# EAGLE design AetherMesh Test Fixture LGA V1.0 (EAGLE 9.0.0)
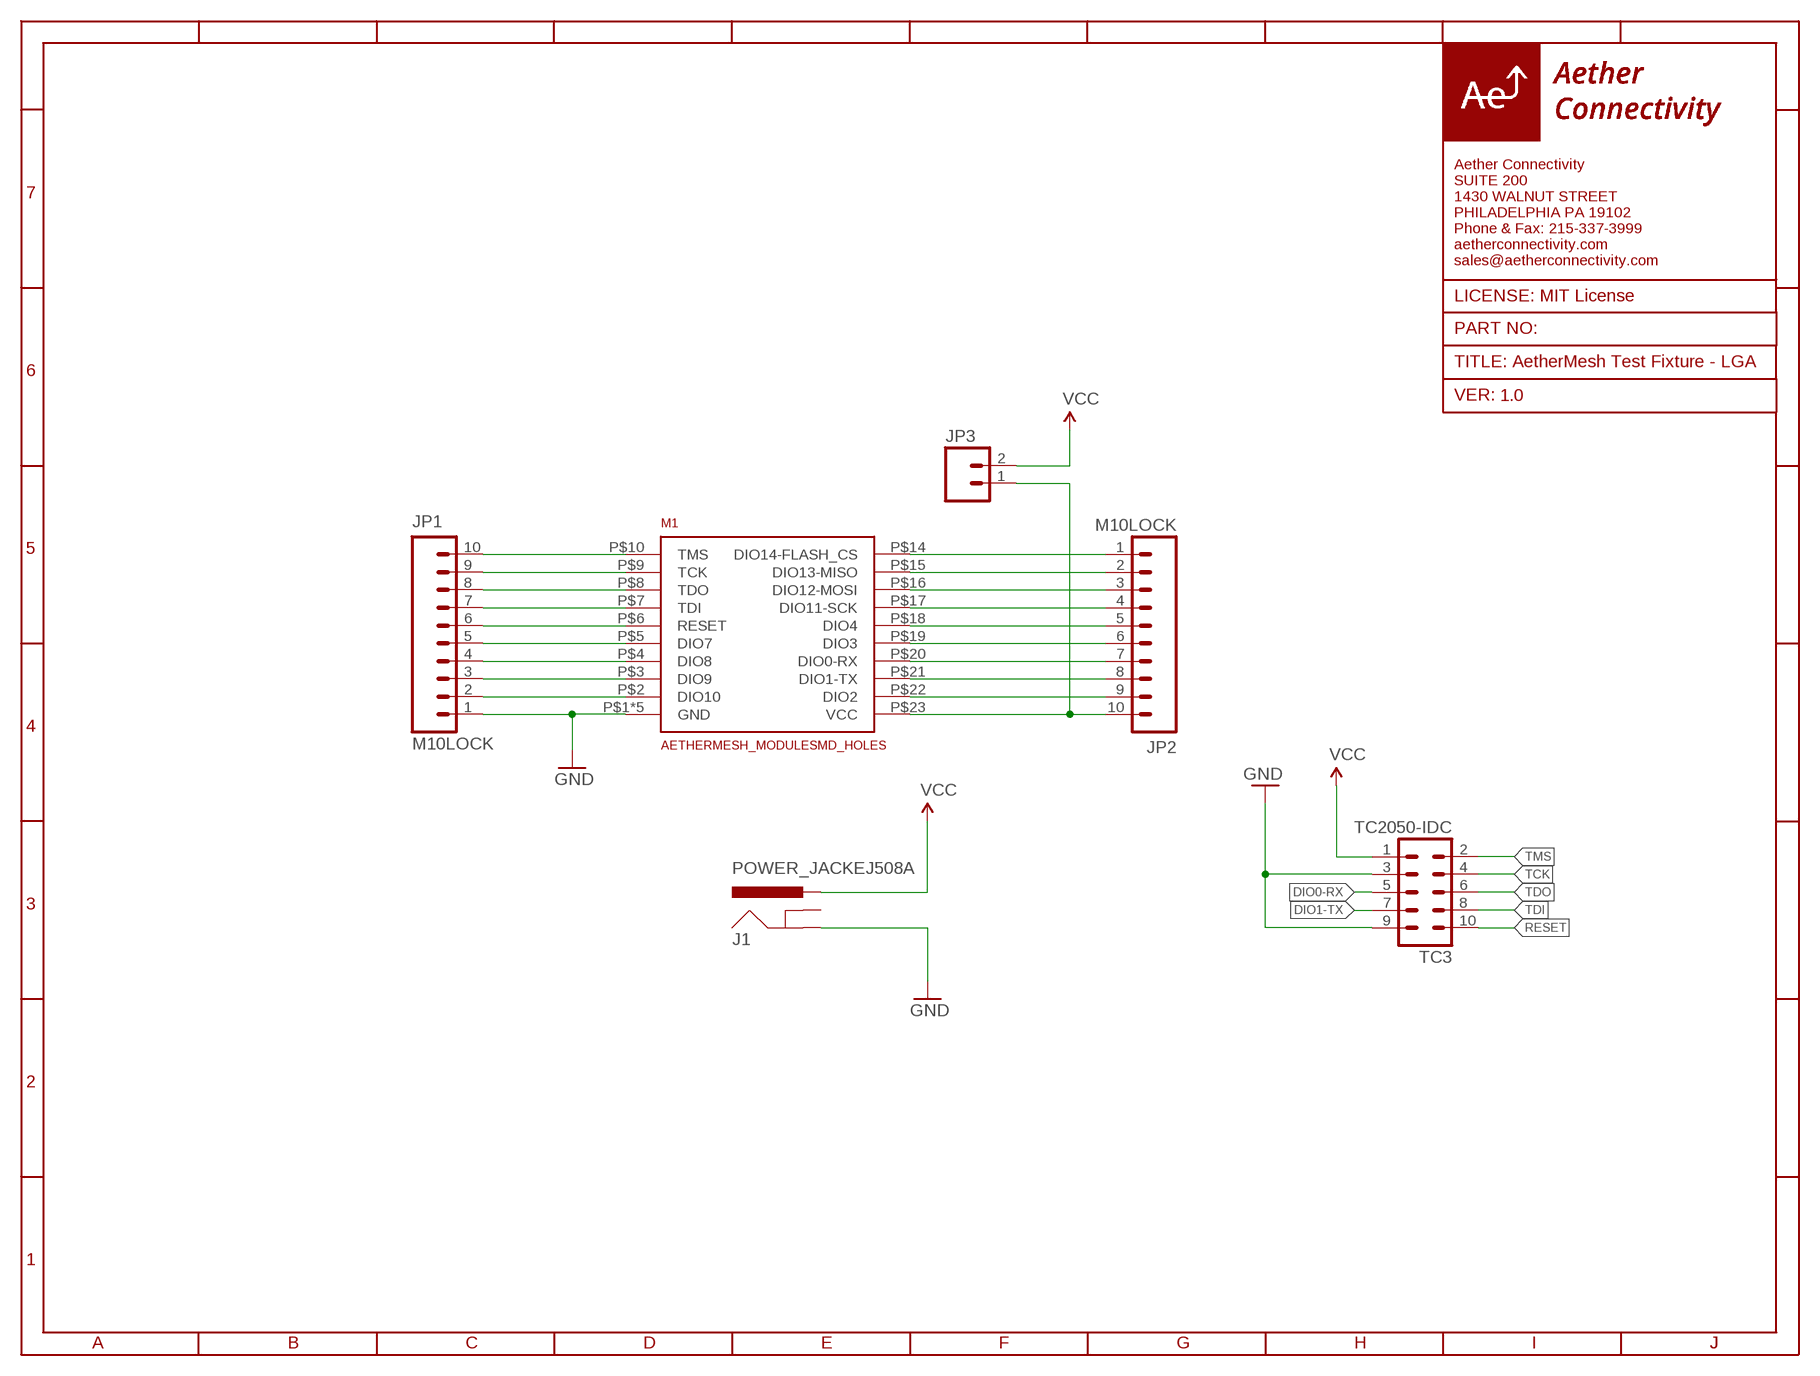
[diagram p0: schematic, sheet 1]

## Parts
J1  POWER_JACKEJ508A  [DC_JACK_EJ508A]
JP1  M10LOCK  [1X10_LOCK]
JP2  M10LOCK  [1X10_LOCK]
JP3  M02LOCK  [1X02_LOCK]
M1  AETHERMESH_MODULESMD_HOLES  [AETHERMESH_SMD_MOUNT_HOLES]
TC3  TC2050-IDC  [TC2050-IDC]

## Nets
BUTTON: JP1.2 M1.P$2(DIO10)
CS: JP1.5 M1.P$5(DIO7)
DIO0-RX: JP2.7 M1.P$20(DIO0-RX) TC3.5
DIO1-TX: JP2.8 M1.P$21(DIO1-TX) TC3.7
DIO2: JP2.9 M1.P$22(DIO2)
DIO3: JP2.6 M1.P$19(DIO3)
DIO4: JP2.5 M1.P$18(DIO4)
ENC_RESET: JP1.4 M1.P$4(DIO8)
GND: J1.1(GND) JP1.1 M1.P$1(GND) M1.P$11(GND) M1.P$12(GND) M1.P$13(GND) M1.P$24(GND) TC3.3 TC3.9
INT: JP1.3 M1.P$3(DIO9)
MISO: JP2.2 M1.P$15(DIO13-MISO)
MOSI: JP2.3 M1.P$16(DIO12-MOSI)
N$1: JP2.1 M1.P$14(DIO14-FLASH_CS)
N$3: JP2.10 JP3.1 M1.P$23(VCC)
RESET: JP1.6 M1.P$6(RESET) TC3.10
SCK: JP2.4 M1.P$17(DIO11-SCK)
TCK: JP1.9 M1.P$9(TCK) TC3.4
TDI: JP1.7 M1.P$7(TDI) TC3.8
TDO: JP1.8 M1.P$8(TDO) TC3.6
TMS: JP1.10 M1.P$10(TMS) TC3.2
VCC: J1.3(PWR) JP3.2 TC3.1
Unconnected: J1.2(GNDBREAK)

## Notes on the sheet
- AetherMesh Test Fixture - LGA
- 1.0

## Library data of the parts
J1 = 3. growflux:POWER_JACK: Power Jack This is the standard 5.5mm barrel jack for power. The PTH is the most common, proven, reliable, footprint. The Slot footprint only works if the mill layer is transmitted to the PCB fab house so be warned. Mating wall wart : TOL-00298 (and others)
JP1 JP2 = 3. growflux:M10: Header 10 Standard 10-pin 0.1" header. Use with straight break away headers (SKU : PRT-00116), right angle break away headers (PRT-00553), swiss pins (PRT-00743), machine pins (PRT-00117), and female headers (PRT-00115).
JP3 = 1. growflux:M02: Header 2 Standard 2-pin 0.1" header. Use with straight break away headers (SKU : PRT-00116), right angle break away headers (PRT-00553), swiss pins (PRT-00743), machine pins (PRT-00117), and female headers (PRT-00115). Molex polarized connector foot print use with SKU : PRT-08233 with associated crimp pins and housings.
M1 = AetherConnectivity:AETHERMESH_MODULE
TC3 = TagConnect:TC2050-IDC: Tag-Connect In Circuit Programming & Debug Cable 10 Pin http://www.tag-connect.com

## Board
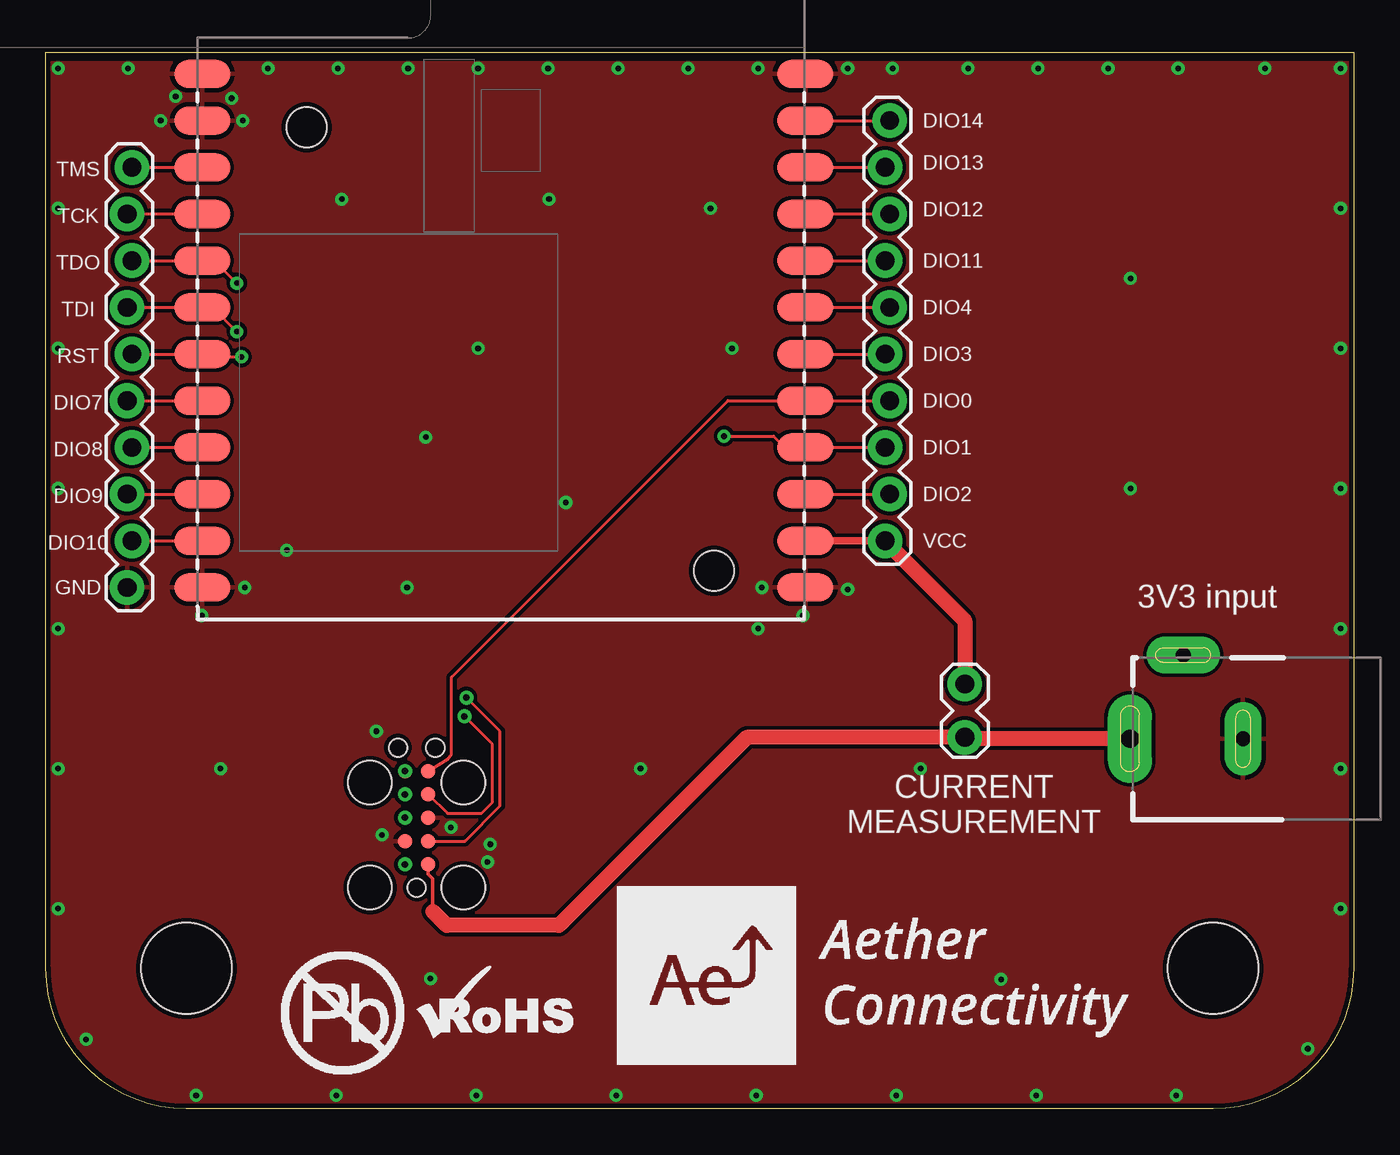
[diagram p1: board, top side]
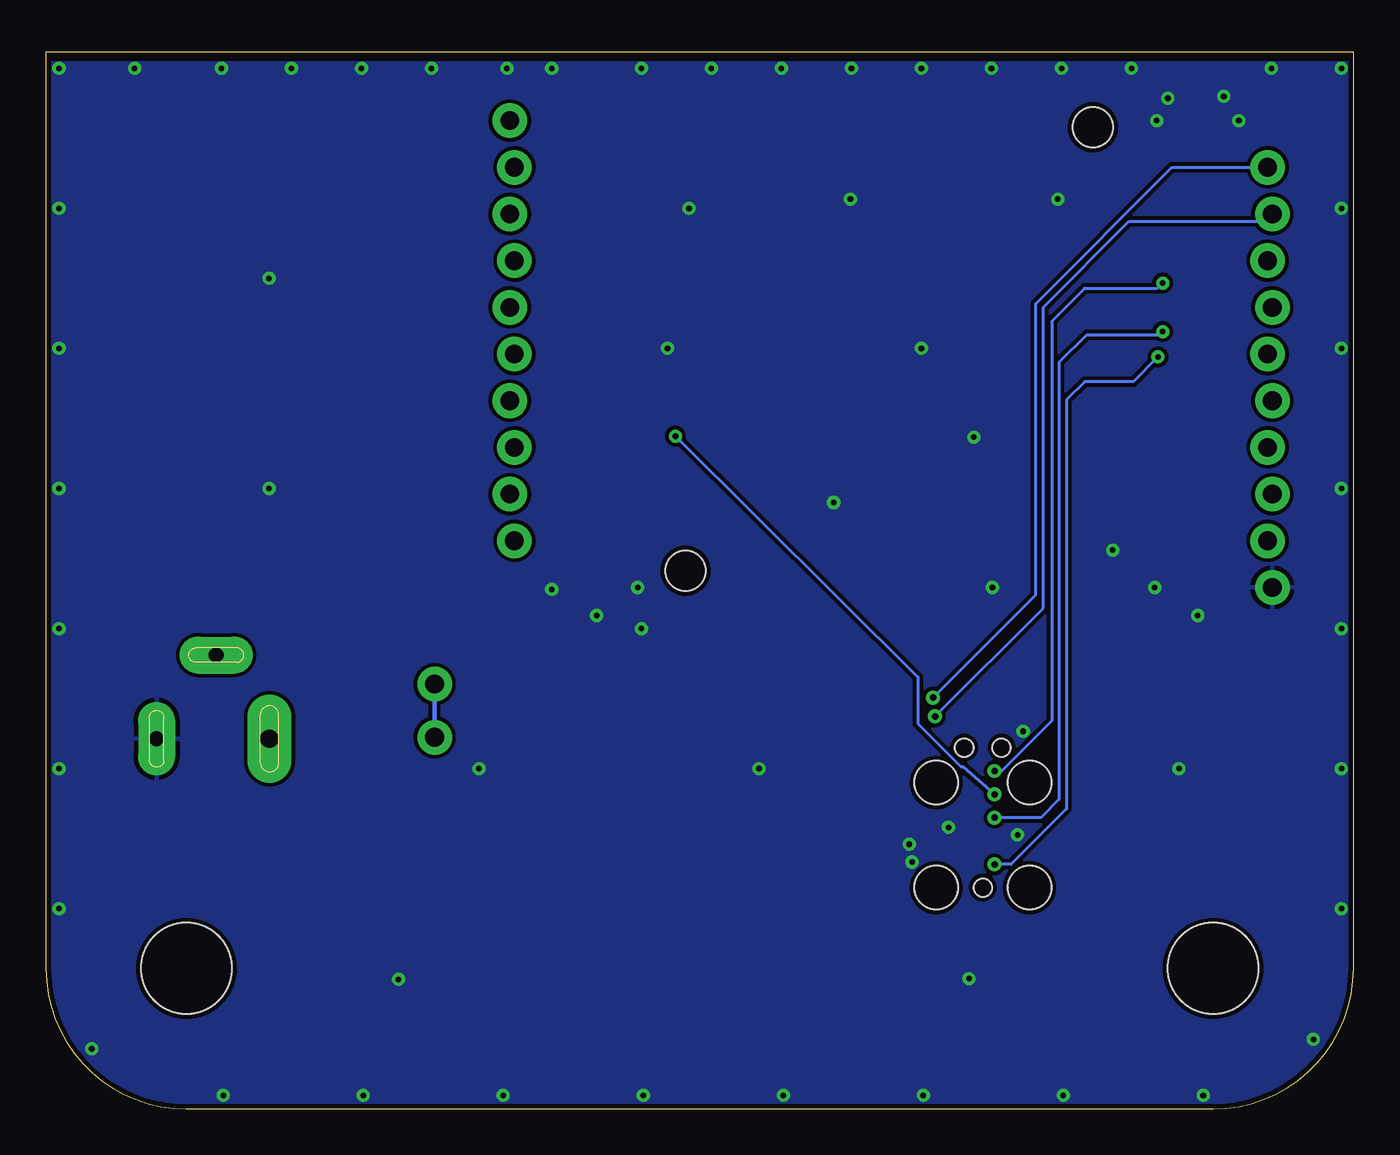
[diagram p2: board, bottom side, seen from below]

Size 71.17 x 57.48 mm. Coordinates in mm from the lower left corner, seen from the top.
Outline: 71.17,7.65 arc-90 63.53,0 7.65,0 arc-90 0,7.65 0,57.48 71.17,57.48 71.17,7.65
Copper layers (1*16): Top 0.035mm / dielectric 1.5mm / Bottom 0.035mm
Design rules "default *": minimum track width 6mil, minimum drill 12mil, track to track 7mil, track to pad 7mil, pad to pad 7mil, via to via 7mil, smd to smd 7mil, copper to edge 10mil, drill to drill 8mil, minimum pad ring 10mil, minimum via ring 8mil, stop-mask expansion 4mil, vias tented up to drill 20mil, thermal gap 10mil
Holes 4.95 mm at 7.65,7.65 63.53,7.65
vRestrict: area 59.4,3.5 to 67.7,11.8; area 3.5,3.5 to 11.8,11.8

### Footprints (pad centres in the part's own frame; a part is rotated, then mirrored left to right if it is on the bottom)
DC_JACK_EJ508A = drill 0.8 pad 2 long: 1 0,0; 2 4.55,3.25 | drill 1 pad 2.4 long: 3 0,6.15
1X10_LOCK = drill 1.016 pad 1.88: 1 0,0.127; 2 2.54,-0.127; 3 5.08,0.127; 4 7.62,-0.127; 5 10.16,0.127; 6 12.7,-0.127; 7 15.24,0.127; 8 17.78,-0.127; 9 20.32,0.127; 10 22.86,-0.127
1X02_LOCK = drill 1.016 pad 1.88: 1 -0.178,0; 2 2.718,0
AETHERMESH_SMD_MOUNT_HOLES = smd 3.048 x 1.524: P$1 0.254,1.727; P$2 0.254,4.267; P$3 0.254,6.807; P$4 0.254,9.347; P$5 0.254,11.887; P$6 0.254,14.427; P$7 0.254,16.967; P$8 0.254,19.507; P$9 0.254,22.047; P$10 0.254,24.587; P$11 0.254,27.127; P$12 0.254,29.667; P$13 33.071,29.667; P$14 33.071,27.127; P$15 33.071,24.587; P$16 33.071,22.047; P$17 33.071,19.507; P$18 33.071,16.967; P$19 33.071,14.427; P$20 33.071,11.887; P$21 33.071,9.347; P$22 33.071,6.807; P$23 33.071,4.267; P$24 33.071,1.727 | hole 2.2: 28.106,2.642; 5.932,26.772
TC2050-IDC = smd 0.787 x 0.787: 1 -2.54,-0.635; 2 -1.27,-0.635; 3 0,-0.635; 4 1.27,-0.635; 5 2.54,-0.635; 6 2.54,0.635; 7 1.27,0.635; 8 0,0.635; 9 -1.27,0.635; 10 -2.54,0.635 | hole 0.991: -3.81,0; 3.81,1.016; 3.81,-1.016 | hole 2.375: -3.81,2.54; -3.81,-2.54; 1.905,2.54; 1.905,-2.54

### Placement (x,y rotation side)
J1  65.15,20.14 90 top
JP1  4.55,28.37 90 top
JP2  45.8,53.77 270 top
JP3  50.01,22.94 270 top
M1  8.26,26.64 0 top
TC3  20.18,15.85 90 top

### Tracks (layer width: path | path; a pad name or v marks a point on that pad's centre or on a via)
BUTTON
  Top 0.152: JP1.2 M1.P$2
CS
  Top 0.152: JP1.5 M1.P$5
DIO0-RX
  Top 0.152: JP2.7 M1.P$20 37.11,38.53 22.07,23.5 22.07,19.33 21.87,19.02 TC3.5
DIO1-TX  (via drill 0.3, 0.35)
  Top 0.152: v36.91,36.6 39.6,36.6 40.06,36.14 41.17,36.14 M1.P$21 JP2.8
  Bottom 0.152: v36.91,36.6 23.7,23.5 23.7,20.96 21.36,18.62 21.26,18.62 TC3.7
  other vias: 19.54,17.12
DIO2
  Top 0.152: M1.P$22 JP2.9
DIO3
  Top 0.152: M1.P$19 JP2.6
DIO4
  Top 0.152: M1.P$18 JP2.5
ENC_RESET
  Top 0.152: JP1.4 M1.P$4
GND  (via drill 0.3)
  other vias: 10.82,28.37 8.48,26.85 41.2,26.85 38.96,28.37 43.64,28.27 43.64,56.62 46.08,56.62 6.25,53.77 7.06,55.09 10.72,53.77 10.11,54.99 0.66,56.62 0.66,49 0.66,41.38 0.66,33.76 0.66,10.9 8.18,0.74 15.9,56.62 23.52,56.62 31.14,56.62 38.76,56.62 54,56.62 61.62,56.62 70.46,56.62 19.71,56.62 27.33,56.62 34.95,56.62 50.19,56.62 57.81,56.62 66.34,56.62 4.47,56.62 12.09,56.62 15.8,0.74 23.42,0.74 38.66,0.74 61.52,0.74 70.46,41.38 70.46,33.76 70.46,26.14 70.46,10.9 16.1,49.5 27.38,49.5 13.11,30.4 23.52,41.38 28.3,32.99 37.34,41.38 38.76,26.14 19.66,28.37 20.68,36.55 17.98,20.55 24.03,13.44 24.18,14.4 0.66,26.14 0.66,18.52 31.04,0.74 46.28,0.74 53.9,0.74 70.46,18.52 70.46,49 59.03,45.19 59.03,33.76 47.6,18.52 32.36,18.52 9.5,18.52 51.98,7.05 20.93,7.09 36.17,49 2.18,3.78 68.68,3.28 22.05,15.32 18.29,14.91
  pour Bottom (isolate 0.203, rank 2): 0.28,56.92 0.28,7.9 arc90 7.9,0.28 63.53,0.28 arc90 70.89,7.65 70.89,56.92
  pour Top (isolate 0.203, rank 2): 0.28,56.92 0.28,7.9 arc90 7.9,0.28 63.53,0.28 arc90 70.89,7.65 70.89,56.92
INT
  Top 0.152: JP1.3 M1.P$3
MISO
  Top 0.152: M1.P$15 JP2.2
MOSI
  Top 0.152: M1.P$16 JP2.3
N$1
  Top 0.152: M1.P$14 JP2.1
N$3
  Top 0.406: M1.P$23 JP2.10
  Top 0.813: JP2.10 50.01,26.57 JP3.1
RESET  (via drill 0.3, 0.35)
  Top 0.152: v10.64,40.92 9.47,40.92 9.47,41.07 M1.P$6 JP1.6
  Bottom 0.152: v10.64,40.92 11.99,39.57 14.63,39.57 15.62,38.58 15.62,16.33 18.65,13.31 TC3.10
  other vias: 19.54,13.31
SCK
  Top 0.152: 41.68,46.15 M1.P$17 JP2.4
TCK  (via drill 0.35)
  Top 0.152: 9.07,48.69 M1.P$9 JP1.9 | TC3.4 21.85,16.08 23.7,16.08 24.31,16.69 24.31,19.84 v22.78,21.36
  Bottom 0.152: v22.78,21.36 16.89,27.25 16.89,43.61 12.22,48.29 4.83,48.29 JP1.9
TDI  (via drill 0.3, 0.35)
  Top 0.152: v10.39,42.29 9.07,43.61 M1.P$7 JP1.7
  Bottom 0.152: v10.39,42.29 10.57,42.11 14.53,42.11 16.03,40.61 16.03,16.84 17.02,15.85 TC3.8
  other vias: 19.54,15.85
TDO  (via drill 0.3, 0.35)
  Top 0.152: v10.39,44.93 9.17,46.15 M1.P$8 JP1.8
  Bottom 0.152: v10.39,44.93 10.67,44.65 14.63,44.65 16.43,42.85 16.43,21.11 19.16,18.39 TC3.6
  other vias: 19.54,18.39
TMS  (via drill 0.35)
  Top 0.152: 9.17,51.23 M1.P$10 JP1.10 | TC3.2 22.81,14.58 24.71,16.48 24.71,20.55 v22.89,22.38
  Bottom 0.152: v22.89,22.38 17.3,27.97 17.3,43.82 9.88,51.23 JP1.10
VCC
  Top 0.203: TC3.1 20.81,12.77 21.06,12.52 21.06,10.74
  Top 0.813: 21.06,10.74 21.82,9.98 27.91,9.98 38.15,20.22 JP3.2 50.09,20.14 J1.3
  Bottom 0.254: JP3.2 50.01,23.09

### Text on the board
tPlace: DIO14 | DIO13 | TMS | DIO12 | TCK | TDO | DIO11 | DIO4 | TDI | RST | DIO3 | DIO0 | DIO7 | DIO8 | DIO1 | DIO2 | DIO9 | VCC | DIO10 | GND | 3V3 input | CURRENT / MEASUREMENT